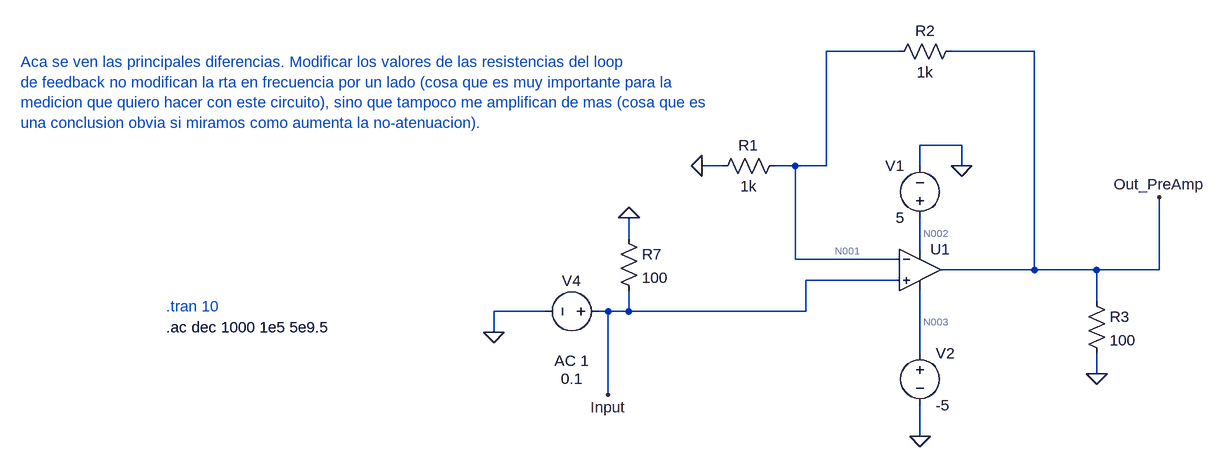
[diagram p0: schematic circuito_calibracion_usando_opamp_ideales.asc]
circuito_calibracion_usando_opamp_ideales.asc, the LTspice schematic file:
Version 4
SHEET 1 880 680
WIRE 0 -144 -112 -144
WIRE 208 -144 80 -144
WIRE 96 0 32 0
WIRE -272 32 -304 32
WIRE -160 32 -192 32
WIRE -112 32 -112 -144
WIRE -112 32 -160 32
WIRE 32 32 32 0
WIRE 96 32 96 0
WIRE -416 144 -416 112
WIRE 32 160 32 112
WIRE -160 176 -160 32
WIRE 0 176 -160 176
WIRE 208 192 208 -144
WIRE 208 192 64 192
WIRE 304 192 208 192
WIRE 400 192 400 80
WIRE 400 192 304 192
WIRE 0 208 -144 208
WIRE 304 240 304 192
WIRE -544 256 -624 256
WIRE -448 256 -464 256
WIRE -416 256 -416 224
WIRE -416 256 -448 256
WIRE -144 256 -144 208
WIRE -144 256 -416 256
WIRE -624 288 -624 256
WIRE 32 320 32 224
WIRE 304 352 304 320
WIRE -448 384 -448 256
WIRE 32 448 32 400
FLAG 32 448 0
FLAG 96 32 0
FLAG 400 80 Out_PreAmp
FLAG 304 352 0
FLAG -624 288 0
FLAG -416 112 0
FLAG -448 384 Input
FLAG -304 32 0
SYMBOL res -176 16 R90
WINDOW 0 0 56 VBottom 2
WINDOW 3 32 56 VTop 2
SYMATTR InstName R1
SYMATTR Value 1k
SYMBOL res 96 -160 R90
WINDOW 0 0 56 VBottom 2
WINDOW 3 32 56 VTop 2
SYMATTR InstName R2
SYMATTR Value 1k
SYMBOL voltage 32 128 R180
WINDOW 0 24 96 Left 2
WINDOW 3 24 16 Left 2
WINDOW 123 0 0 Left 0
WINDOW 39 0 0 Left 0
SYMATTR InstName V1
SYMATTR Value 5
SYMBOL OpAmps\\UniversalOpAmp1 32 192 R0
SYMATTR InstName U1
SYMATTR Value2 Avol=1Meg GBW=800Meg Vos=0
SYMBOL res 288 224 R0
SYMATTR InstName R3
SYMATTR Value 100
SYMBOL voltage -448 256 R90
WINDOW 0 -32 56 VBottom 2
WINDOW 3 88 56 VTop 2
WINDOW 123 60 56 VTop 2
WINDOW 39 0 0 Left 0
SYMATTR InstName V4
SYMATTR Value 0.1
SYMATTR Value2 AC 1
SYMBOL res -432 128 R0
SYMATTR InstName R7
SYMATTR Value 100
SYMBOL voltage 32 304 R0
WINDOW 123 0 0 Left 0
WINDOW 39 0 0 Left 0
SYMATTR InstName V2
SYMATTR Value -5
TEXT -1128 280 Left 2 !.ac dec 1000 1e5 5e9.5
TEXT -1128 248 Left 2 ;.tran 10
TEXT -1352 -128 Left 2 ;Aca se ven las principales diferencias. Modificar los valores de las resistencias del loop\nde feedback no modifican la rta en frecuencia por un lado (cosa que es muy importante para la\nmedicion que quiero hacer con este circuito), sino que tampoco me amplifican de mas (cosa que es\nuna conclusion obvia si miramos como aumenta la no-atenuacion).

The netlist it stands for:
* circuito_calibracion_usando_opamp_ideales.asc
R1 N001 0 1k
R2 Out_PreAmp N001 1k
V1 N002 0 5
XU1 Input N001 N002 N003 Out_PreAmp level1 Avol=1Meg GBW=800Meg Vos=0 En=0 Enk=0 In=0 Ink=0 Rin=500Meg  ; pins In+ In- V+ V- OUT
R3 Out_PreAmp 0 100
V4 Input 0 0.1 AC 1
R7 0 Input 100
V2 N003 0 -5
.ac dec 1000 1e5 5e9.5
* .tran 10
* Aca se ven las principales diferencias. Modificar los valores de las resistencias del loop
* de feedback no modifican la rta en frecuencia por un lado (cosa que es muy importante para la
* medicion que quiero hacer con este circuito), sino que tampoco me amplifican de mas (cosa que es
* una conclusion obvia si miramos como aumenta la no-atenuacion).
.lib UniversalOpAmp1.lib
.backanno
.end

* Results of the author's LTspice run, read from the files saved beside the schematic
* Operating Point, zero values left out:
*   V(n001) = 100 mV
*   V(out_preamp) = 200 mV
*   V(n002) = 5 V
*   V(input) = 100 mV
*   V(n003) = -5 V
*   I(R1) = 100 µA
*   I(R2) = 100 µA
*   I(R3) = 2 mA
*   I(R7) = -1 mA
*   I(V1) = -9.8 nA
*   I(V4) = -1 mA
*   I(V2) = 10.2 nA
*   Ix(u1:1) = 200 pA
*   Ix(u1:2) = 200 pA
*   Ix(u1:3) = 9.8 nA
*   Ix(u1:4) = -10.2 nA
*   Ix(u1:5) = -2.1 mA
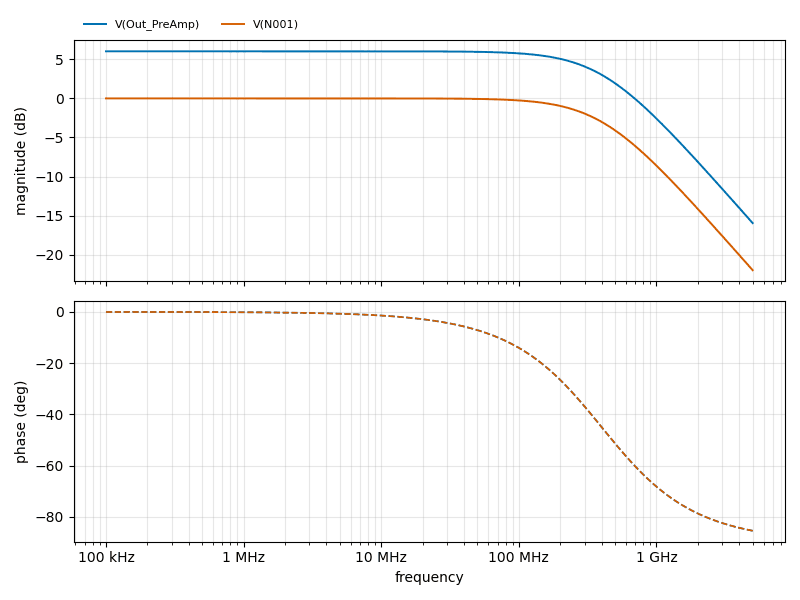
[diagram p1: AC Analysis of circuito_calibracion_usando_opamp_ideales.asc, plotted from the saved traces]
* AC Analysis, 1 run:
*   V(Out_PreAmp): 6.02 dB at 100 kHz, -15.95 dB at 5 GHz, peak 6.02 dB at 100 kHz, 3 dB below the peak at 400 MHz
*   V(N001): -0.00 dB at 100 kHz, -21.97 dB at 5 GHz, peak -0.00 dB at 100 kHz, 3 dB below the peak at 400 MHz